# EasyEDA Pro project ProPrj_辉光管_2024.2.16_2024-11-09.epro, board PCB8
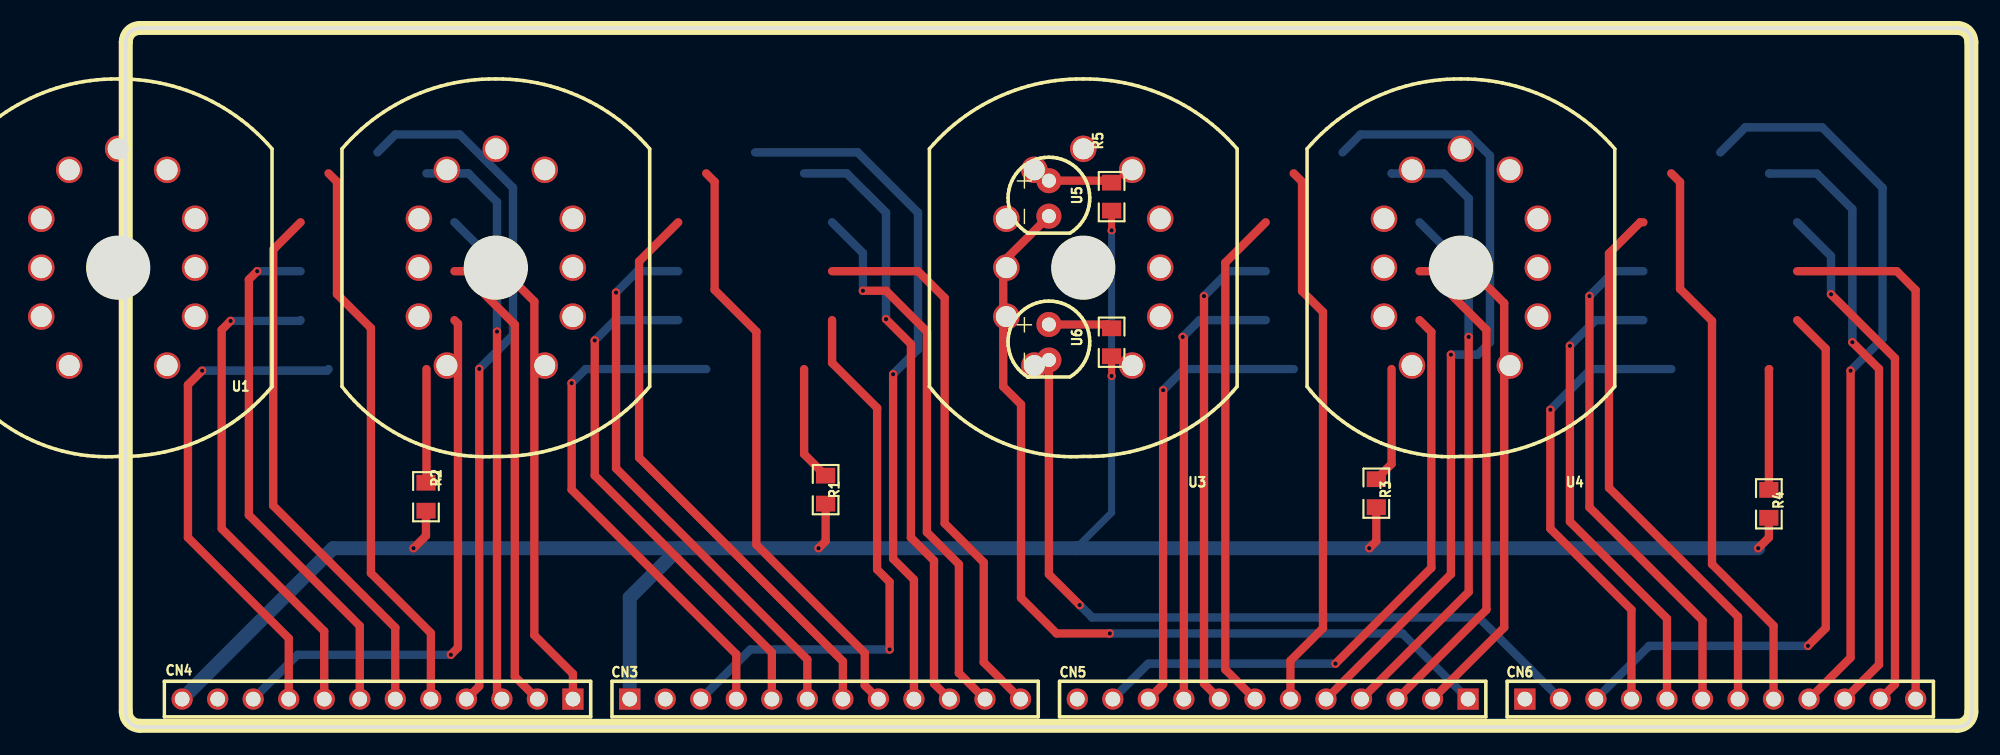
[diagram p2: board, top side]
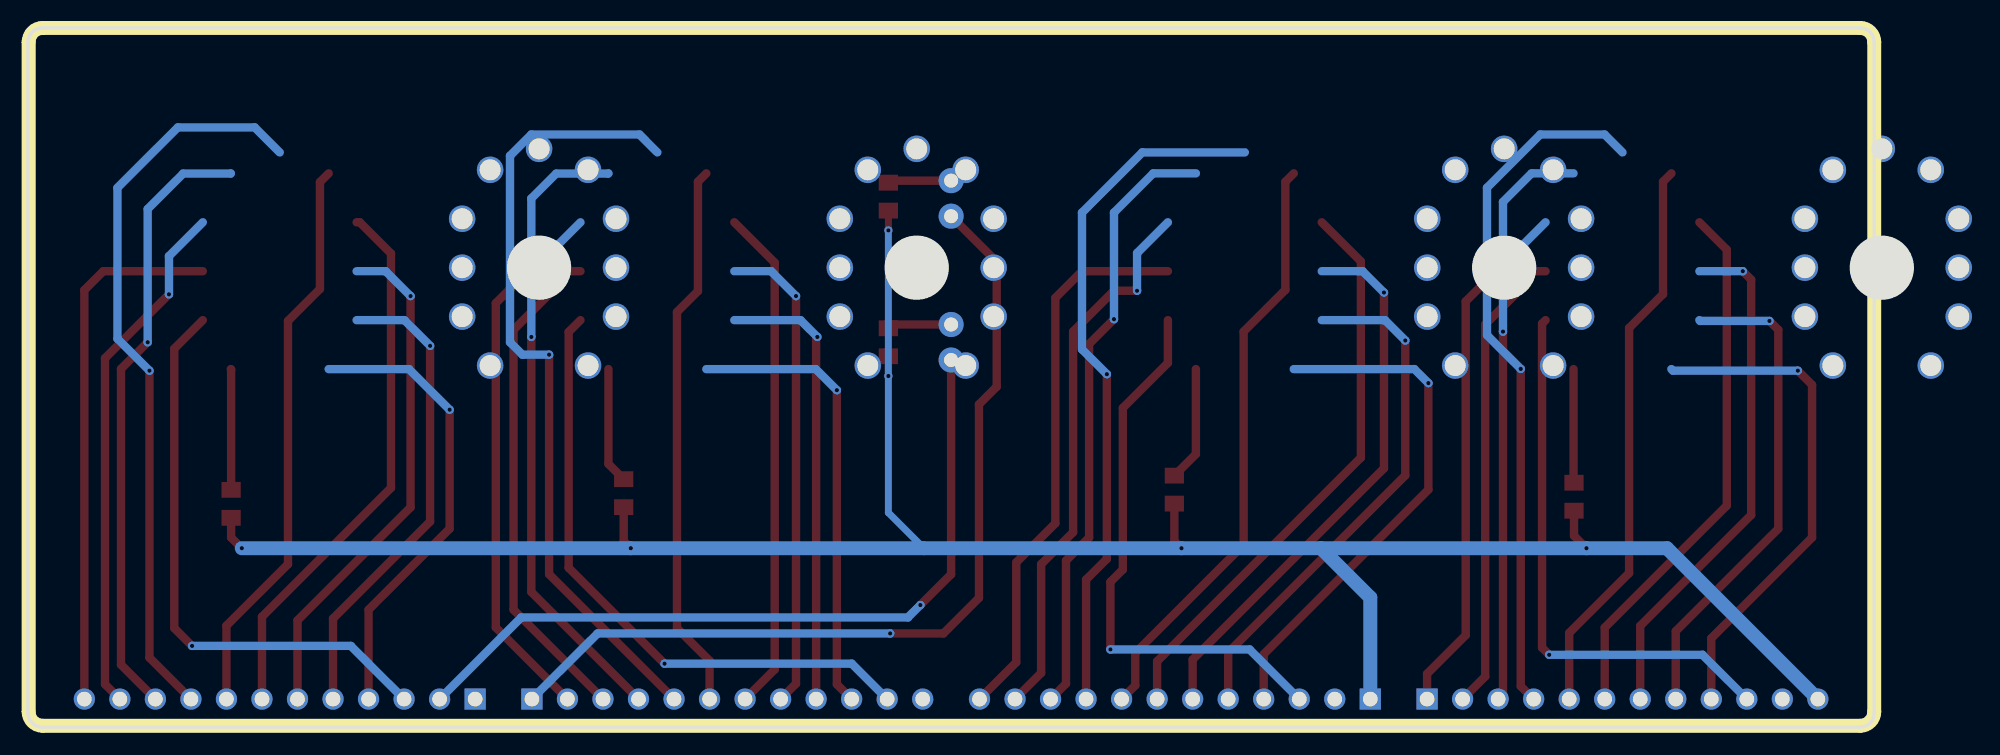
[diagram p3: board, bottom side, seen from below]

Outline 134.84 x 50 mm; copper layers: Top Layer, Bottom Layer. Coordinates in mm from the lower left corner of the outline.
Outline path: 2.84,49 2.84,1 arc(3.13,0.29) 3.84,0 133.84,0 arc(134.54,0.29) 134.84,1 134.84,49 arc(134.54,49.71) 133.84,50 3.84,50 arc(3.13,49.71) 2.84,49
Stack: Top Layer 0.035mm / Dielectric1 1.51mm FR4 er 4.5 / Bottom Layer 0.035mm

## Design rules (mm)
template: 自定义配置
spacing copperThickness1oz (default): track to track 0.102, other pairs 0.152 to 0.3
spacing copperThickness2oz: track to track 0.203, other pairs 0.152 to 0.3
track width copperThickness1oz (default): min 0.127, default 0.254, max 2.54
track width copperThickness2oz: min 0.203, default 0.254, max 2.54
differential pair differentialPair (default): width min 0.127, default 0.254, max 2.54; gap min 0.152, default 0.152
via viaSize (default): diameter min 0.5, default 0.61, max 10; hole min 0.3, default 0.305, max 6.3

## Placement (name value [footprint] x y rotation side)
CN3  HB-PH3-254112PB2GOP  [HDR-TH_12P-P2.54-V-M]  52.84 2 0 top
CN4  HB-PH3-254112PB2GOP  [HDR-TH_12P-P2.54-V-M]  20.84 2 180 top
CN5  HB-PH3-254112PB2GOP  [HDR-TH_12P-P2.54-V-M]  84.84 2 180 top
CN6  HB-PH3-254112PB2GOP  [HDR-TH_12P-P2.54-V-M]  116.84 2 0 top
R1  33kΩ  [R0805]  52.88 16.98 270 top
R2  33kΩ  [R0805]  24.3 16.47 270 top
R3  33kΩ  [R0805]  92.25 16.73 270 top
R4  33kΩ  [R0805]  120.31 15.96 270 top
R5  47kΩ  [R0805]  73.32 37.94 270 top
R6  47kΩ  [R0805]  73.32 27.52 270 top
U1  -  [QS27]  20.84 32.6 0 top
U2  -  [QS27]  47.84 32.6 0 top
U3  -  [QS27]  89.84 32.6 0 top
U4  -  [QS27]  116.84 32.6 0 top
U5  LTL-307E  [LED-TH_BD5.9-P2.54-RD_RED]  68.84 37.81 90 top
U6  LTL-307E  [LED-TH_BD5.9-P2.54-RD_RED]  68.84 27.52 90 top

## Footprints (pads in the part's own frame, mm; a bottom-side part is the same pattern mirrored in y, then rotated)
HDR-TH_12P-P2.54-V-M
  rect 1.524x1.524 hole 1.05: 1(-13.97,0)
  round 1.524 hole 1.05: 2(-11.43,0) 3(-8.89,0) 4(-6.35,0) 5(-3.81,0) 6(-1.27,0) 7(1.27,0) 8(3.81,0) 9(6.35,0) 10(8.89,0) 11(11.43,0) 12(13.97,0)
LED-TH_BD5.9-P2.54-RD_RED
  round 1.8 hole 1: 1(-1.27,0) 2(1.27,0)
QS27
  round 1.9 hole 1.5: 1(-15.042,-6.746) 2(-13.042,-3.246) 3(-13.042,0.254) 4(-13.042,3.754) 5(-15.042,7.254) 6(-18.542,8.754) 7(-22.042,7.254) 8(-24.042,3.754) 9(-24.042,0.254) 10(-24.042,-3.246) 11(-22.042,-6.746)
R0805
  rect 1.133x1.377 smd: 1(-1,0) 2(1,0)

## Nets
G1_0: CN4.10 U1.2
G1_1: CN4.9 U1.11
G1_2: CN4.8 U1.10
G1_3: CN4.7 U1.9
G1_4: CN4.6 U1.8
G1_5: CN4.5 U1.7
G1_6: CN4.4 U1.6
G1_7: CN4.3 U1.5
G1_8: CN4.2 U1.4
G1_9: CN4.1 U1.3
G2_0: CN3.3 U2.2
G2_1: CN3.4 U2.11
G2_2: CN3.5 U2.10
G2_3: CN3.6 U2.9
G2_4: CN3.7 U2.8
G2_5: CN3.8 U2.7
G2_6: CN3.9 U2.6
G2_7: CN3.10 U2.5
G2_8: CN3.11 U2.4
G2_9: CN3.12 U2.3
G3_0: CN5.11 U3.2
G3_1: CN5.10 U3.11
G3_2: CN5.9 U3.10
G3_3: CN5.8 U3.9
G3_4: CN5.7 U3.8
G3_5: CN5.6 U3.7
G3_6: CN5.5 U3.6
G3_7: CN5.4 U3.5
G3_8: CN5.3 U3.4
G3_9: CN5.2 U3.3
G4_0: CN6.3 U4.2
G4_1: CN6.4 U4.11
G4_2: CN6.5 U4.10
G4_3: CN6.6 U4.9
G4_4: CN6.7 U4.8
G4_5: CN6.8 U4.7
G4_6: CN6.9 U4.6
G4_7: CN6.10 U4.5
G4_8: CN6.11 U4.4
G4_9: CN6.12 U4.3
HGD_1: CN5.1 U5.1
HGD_2: CN6.2 U6.1
HV: CN3.1 CN4.12 R1.2 R2.2 R3.2 R4.2 R5.2 R6.2
$1N2845: R2.1 U1.1
$1N2867: R3.1 U3.1
$1N3020: R5.1 U5.2
$1N3024: R6.1 U6.2
$1N3056: R1.1 U2.1
$1N3057: R4.1 U4.1

Pads without a net: CN3 2; CN4 11; CN5 12; CN6 1

## Via types
v1: diameter 0.6, hole 0.3, Top Layer to Bottom Layer, 36 vias

## Routing (per net, layer and track width the routed paths; a pad name or vN(x,y) marks a point on that pad's centre or on a via; arc(x,y) is an arc through that point)
G1_0: length 39.7
  Top Layer w0.6: v1(26.08,5.17) 26.59,5.68 26.59,28.85 26.34,29.1
  Bottom Layer w0.6: v1(26.08,5.17) 15.12,5.17 CN4.10
G1_1: length 36
  Top Layer w0.6: CN4.9 14.49,6.35 7.28,13.55 7.28,24.47 v1(8.3,25.49)
  Bottom Layer w0.6: 17.34,25.6 17.23,25.49 v1(8.3,25.49)
G1_2: length 35.4
  Top Layer w0.6: v1(10.33,29.05) 9.7,28.41 9.7,14.19 17.03,6.85 CN4.8
  Bottom Layer w0.6: v1(10.33,29.05) 15.28,29.05 15.34,29.1
G1_3: length 37.2
  Top Layer w0.6: v1(12.24,32.6) 11.64,32 11.64,15.17 19.57,7.23 CN4.7
  Bottom Layer w0.6: v1(12.24,32.6) 15.34,32.6
G1_4: length 38.5
  Top Layer w0.6: 15.34,36.1 13.38,34.14 13.38,15.84 22.11,7.11 CN4.6
G1_5: length 40.6
  Top Layer w0.6: CN4.5 24.65,6.73 20.36,11.01 20.36,28.54 17.94,30.96 17.94,39 17.34,39.6
G1_6: length 49.7
  Top Layer w0.6: CN4.4 28.11,2.92 v1(28.11,25.62)
  Bottom Layer w0.6: v1(28.11,25.62) 30.52,28.03 30.52,38.57 26.71,42.38 22.12,42.38 20.84,41.1
G1_7: length 41.6
  Top Layer w0.6: v1(29.38,28.28) 29.38,2.35 29.73,2
  Bottom Layer w0.6: v1(29.38,28.28) 29.38,37.55 27.33,39.6 24.34,39.6
G1_8: length 36.6
  Top Layer w0.6: CN4.2 30.65,3.62 30.65,28.79 v1(28.24,31.2)
  Bottom Layer w0.6: v1(28.24,31.2) 28.24,34.2 26.34,36.1
G1_9: length 36.2
  Top Layer w0.6: 26.34,32.6 29.89,32.6 32.05,30.44 32.05,6.57 34.81,3.81 CN4.1
G2_0: length 40.2
  Top Layer w0.6: v1(57.45,5.55) 57.45,10.38 56.56,11.27 56.56,22.82 53.34,26.04 53.34,29.1
  Bottom Layer w0.6: v1(57.45,5.55) 47.5,5.55 CN3.3
G2_1: length 37.5
  Top Layer w0.6: CN3.4 46.49,5.21 34.71,16.98 v1(34.71,24.6)
  Bottom Layer w0.6: v1(34.71,24.6) 35.72,25.6 44.34,25.6
G2_2: length 37.5
  Top Layer w0.6: CN3.5 49.03,5.33 36.37,18 v1(36.37,27.65)
  Bottom Layer w0.6: 42.34,29.1 37.82,29.1 v1(36.37,27.65)
G2_3: length 39.8
  Top Layer w0.6: v1(37.89,31.08) 37.89,18.5 51.57,4.83 CN3.6
  Bottom Layer w0.6: v1(37.89,31.08) 39.41,32.6 42.34,32.6
G2_4: length 41.3
  Top Layer w0.6: 42.34,36.1 39.54,33.3 39.54,19.27 54.11,4.7 CN3.7
G2_5: length 42.7
  Top Layer w0.6: CN3.8 55.67,2.98 55.67,5.3 47.92,13.04 47.92,28.28 44.94,31.27 44.94,39 44.34,39.6
G2_6: length 49.6
  Top Layer w0.6: v1(57.7,25.23) 57.7,12.03 59.19,10.54 CN3.9
  Bottom Layer w0.6: 47.84,41.1 55.17,41.1 59.48,36.79 59.48,27.01 v1(57.7,25.23)
G2_7: length 43.7
  Top Layer w0.6: CN3.10 60.62,3.11 60.62,11.9 58.97,13.55 58.97,27.39 v1(57.19,29.17)
  Bottom Layer w0.6: v1(57.19,29.17) 57.19,36.79 54.38,39.6 51.34,39.6
G2_8: length 39.6
  Top Layer w0.6: CN3.11 62.4,3.87 62.4,11.65 60.11,13.93 60.11,28.28 57.19,31.2 v1(55.54,31.2)
  Bottom Layer w0.6: 53.34,36.1 55.54,33.9 v1(55.54,31.2)
G2_9: length 39.8
  Top Layer w0.6: 53.34,32.6 59.48,32.6 61.38,30.7 61.38,14.57 64.18,11.77 64.18,4.63 CN3.12
G3_0: length 44.7
  Top Layer w0.6: v1(89.32,4.53) 96.18,11.39 96.18,28.26 95.34,29.1
  Bottom Layer w0.6: v1(89.32,4.53) 75.94,4.53 CN5.11
G3_1: length 32.5
  Top Layer w0.6: CN5.10 77.01,3.06 v1(77.01,24.09)
  Bottom Layer w0.6: 86.34,25.6 78.51,25.6 v1(77.01,24.09)
G3_2: length 32.4
  Top Layer w0.6: v1(78.4,27.9) 78.49,27.82 CN5.9
  Bottom Layer w0.6: 84.34,29.1 79.6,29.1 v1(78.4,27.9)
G3_3: length 34.4
  Top Layer w0.6: v1(79.93,30.82) 79.93,3.1 CN5.8
  Bottom Layer w0.6: v1(79.93,30.82) 81.7,32.6 84.34,32.6
G3_4: length 36.2
  Top Layer w0.6: CN5.7 81.45,4.12 81.45,33.21 84.34,36.1
G3_5: length 39.4
  Top Layer w0.6: 86.34,39.6 86.94,39 86.94,31.18 88.44,29.68 88.44,7.07 86.11,4.75 CN5.6
G3_6: length 56.5
  Top Layer w0.6: CN5.5 97.58,10.93 v1(97.58,26.63)
  Bottom Layer w0.6: 89.84,41.1 91.12,42.38 98.85,42.38 100.37,40.86 100.37,27.52 99.48,26.63 v1(97.58,26.63)
G3_7: length 45.2
  Top Layer w0.6: v1(98.85,27.9) 98.85,9.66 CN5.4
  Bottom Layer w0.6: 93.34,39.6 93.35,39.59 97.07,39.59 98.85,37.81 v1(98.85,27.9)
G3_8: length 38.7
  Top Layer w0.6: CN5.3 100.12,8.39 100.12,28.41 v1(97.33,31.2)
  Bottom Layer w0.6: 95.34,36.1 97.33,34.11 v1(97.33,31.2)
G3_9: length 37.4
  Top Layer w0.6: CN5.2 101.39,7.12 101.39,30.31 99.1,32.6 95.34,32.6
G4_0: length 41.4
  Top Layer w0.6: 122.34,29.1 124.38,27.06 124.38,7.07 v1(123.11,5.8)
  Bottom Layer w0.6: v1(123.11,5.8) 111.75,5.8 CN6.3
G4_1: length 32.9
  Top Layer w0.6: v1(104.69,22.69) 104.69,14.19 110.49,8.39 CN6.4
  Bottom Layer w0.6: v1(104.69,22.69) 107.6,25.6 113.34,25.6
G4_2: length 34.1
  Top Layer w0.6: v1(106.09,27.27) 106.09,14.69 113.03,7.75 CN6.5
  Bottom Layer w0.6: v1(106.09,27.27) 107.92,29.1 111.34,29.1
G4_3: length 36.8
  Top Layer w0.6: v1(107.49,30.82) 107.49,15.71 115.57,7.63 CN6.6
  Bottom Layer w0.6: 111.34,32.6 109.26,32.6 v1(107.49,30.82)
G4_4: length 39.1
  Top Layer w0.6: 111.34,36.1 111.11,36.1 108.88,33.87 108.88,17.11 118.11,7.88 CN6.7
G4_5: length 40.6
  Top Layer w0.6: 113.34,39.6 113.96,38.98 113.96,31.33 116.25,29.05 116.25,11.65 120.65,7.25 CN6.8
G4_6: length 52.9
  Top Layer w0.6: CN6.9 126.15,4.97 v1(126.15,25.49)
  Bottom Layer w0.6: v1(126.15,25.49) 128.44,27.78 128.44,38.57 124.12,42.89 118.62,42.89 116.84,41.1
G4_7: length 43.9
  Top Layer w0.6: v1(126.28,27.52) 128.19,25.62 128.19,4.46 CN6.10
  Bottom Layer w0.6: v1(126.28,27.52) 126.28,37.05 123.74,39.59 120.35,39.59 120.34,39.6
G4_8: length 37.4
  Top Layer w0.6: CN6.11 129.33,3.06 129.33,26.38 v1(124.76,30.95)
  Bottom Layer w0.6: v1(124.76,30.95) 124.76,33.68 122.34,36.1
G4_9: length 38.3
  Top Layer w0.6: CN6.12 130.81,31.25 129.46,32.6 122.34,32.6
HGD_1: length 64.1
  Top Layer w0.6: U5.1 65.58,33.28 65.58,24.35 66.85,23.08 66.85,9.23 69.39,6.69 v1(73.2,6.69)
  Bottom Layer w0.6: v1(73.2,6.69) 94.11,6.69 CN5.1
HGD_2: length 55.6
  Top Layer w0.6: v1(71.04,8.72) 68.84,10.92 U6.1
  Bottom Layer w0.6: v1(71.04,8.72) 71.93,7.84 99.57,7.84 CN6.2
HV: length 168.1
  Top Layer w0.5: v1(73.32,25.11) R6.2 ; R5.2 v1(73.32,35.52)
  Top Layer w0.6: R1.2 52.88,13.3 v1(52.37,12.79) ; R4.2 120.31,13.55 v1(119.55,12.79) ; 91.74,12.79 92.25,13.3 R3.2 ; R2.2 24.3,13.68 v1(23.41,12.79)
  Bottom Layer w0.5: 70.78,12.79 73.32,15.33 v1(73.32,25.11) v1(73.32,35.52)
  Bottom Layer w1: CN4.12 17.66,12.79 v1(23.41,12.79) 42.39,12.79 ; v1(119.55,12.79) v1(91.74,12.79) v1(52.37,12.79) 42.39,12.79 ; 42.39,12.79 38.87,9.27 CN3.1
$1N2845: length 8.1
  Top Layer w0.6: R2.1 24.34,17.51 24.34,25.6
$1N2867: length 8.3
  Top Layer w0.6: 93.34,25.6 93.34,18.82 R3.1
$1N3020: length 4.5
  Top Layer w0.6: R5.1 73.18,39.08 U5.2
$1N3024: length 4.6
  Top Layer w0.6: U6.2 73.05,28.79 R6.1
$1N3056: length 8.3
  Top Layer w0.6: R1.1 51.34,19.52 51.34,25.6
$1N3057: length 8.6
  Top Layer w0.6: 120.34,25.6 120.31,25.58 R4.1
